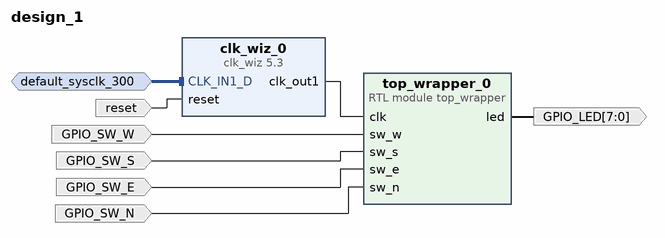
[diagram p0: block diagram of the top level]
# Vivado block design design_1, xcku040-ffva1156-2-e, Vivado 2016.4
create_bd_design design_1

create_bd_intf_port -mode Slave -vlnv xilinx.com:interface:diff_clock_rtl:1.0 default_sysclk_300
set_property -dict {CONFIG.FREQ_HZ 300000000} [get_bd_intf_ports default_sysclk_300]
create_bd_port -dir I -type data GPIO_SW_W
create_bd_port -dir I -type data GPIO_SW_S
create_bd_port -dir I -type data GPIO_SW_E
create_bd_port -dir I -type data GPIO_SW_N
create_bd_port -dir O -from 7 -to 0 -type data GPIO_LED
create_bd_port -dir I -type rst reset
set_property -dict {CONFIG.POLARITY ACTIVE_HIGH} [get_bd_ports reset]

create_bd_cell -type module -reference top_wrapper top_wrapper_0
create_bd_cell -type ip -vlnv xilinx.com:ip:clk_wiz:5.3 clk_wiz_0
set_property -dict [list \
  CONFIG.USE_BOARD_FLOW true \
  CONFIG.CLK_IN1_BOARD_INTERFACE default_sysclk_300 \
  CONFIG.RESET_BOARD_INTERFACE reset \
] [get_bd_cells clk_wiz_0]

# ---- connections ----

connect_bd_intf_net -intf_net default_sysclk_300_1 [get_bd_intf_ports default_sysclk_300] [get_bd_intf_pins clk_wiz_0/CLK_IN1_D]
connect_bd_net [get_bd_ports GPIO_SW_W] [get_bd_pins top_wrapper_0/sw_w]
connect_bd_net [get_bd_ports GPIO_SW_S] [get_bd_pins top_wrapper_0/sw_s]
connect_bd_net [get_bd_ports GPIO_SW_E] [get_bd_pins top_wrapper_0/sw_e]
connect_bd_net [get_bd_ports GPIO_SW_N] [get_bd_pins top_wrapper_0/sw_n]
connect_bd_net [get_bd_pins clk_wiz_0/clk_out1] [get_bd_pins top_wrapper_0/clk]
connect_bd_net [get_bd_pins top_wrapper_0/led] [get_bd_ports GPIO_LED]
connect_bd_net [get_bd_ports reset] [get_bd_pins clk_wiz_0/reset]

validate_bd_design
save_bd_design
